# EAGLE design v1 (EAGLE 9.1.0)
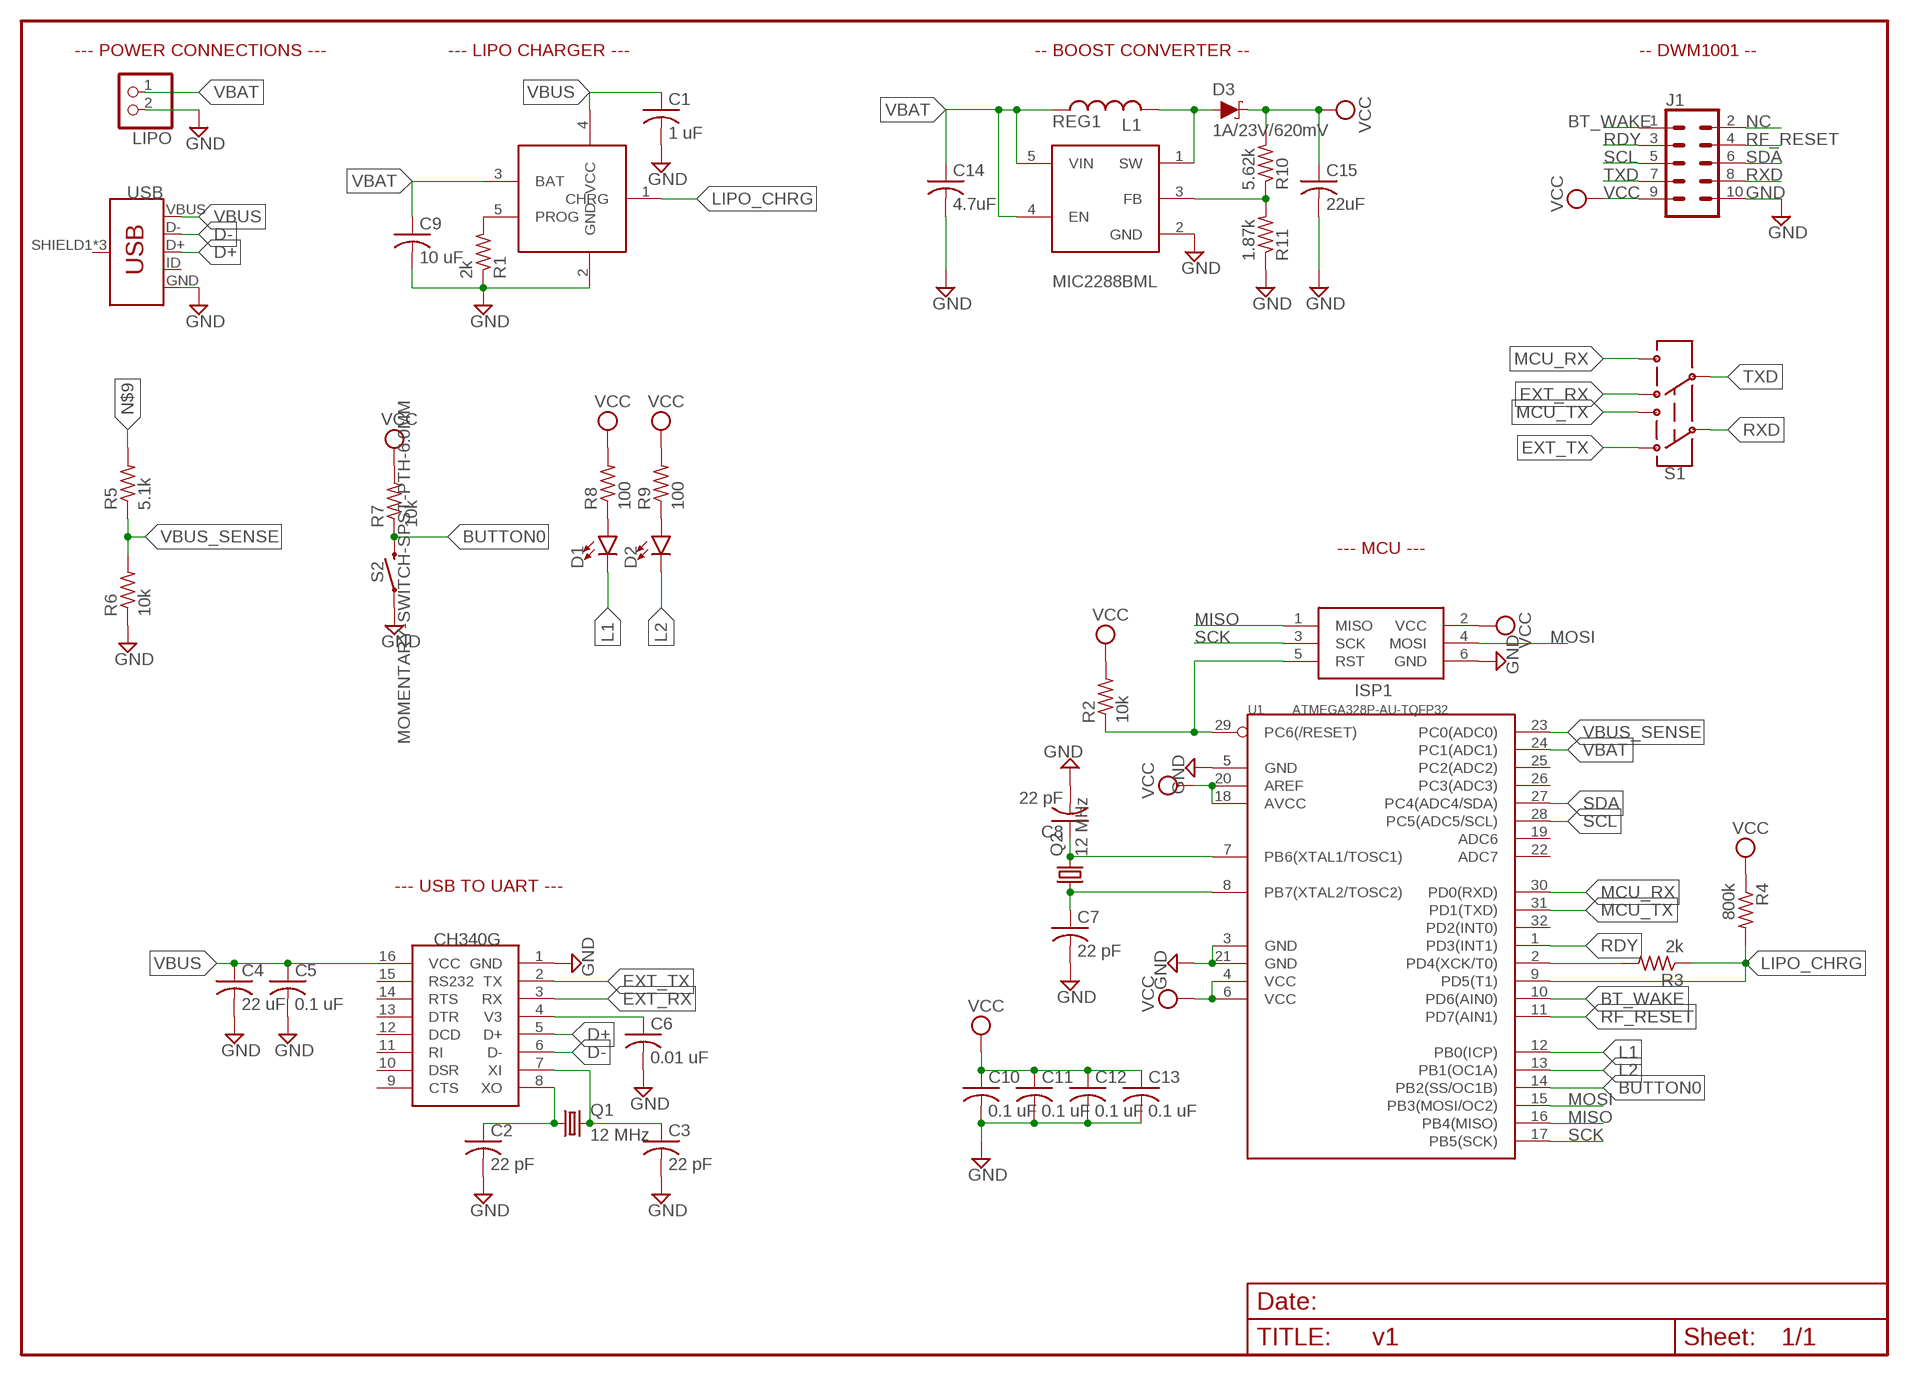
[diagram p0: schematic, sheet 1]

## Parts
C1  1 uF  C-USC0603  [C0603]
C2  22 pF  C-USC0603  [C0603]
C3  22 pF  C-USC0603  [C0603]
C4  22 uF  C-USC0603  [C0603]
C5  0.1 uF  C-USC0603  [C0603]
C6  0.01 uF  C-USC0603  [C0603]
C7  22 pF  C-USC0603  [C0603]
C8  22 pF  C-USC0603  [C0603]
C9  10 uF  C-USC0603  [C0603]
C10  0.1 uF  C-USC0603  [C0603]
C11  0.1 uF  C-USC0603  [C0603]
C12  0.1 uF  C-USC0603  [C0603]
C13  0.1 uF  C-USC0603  [C0603]
C14  4.7uF  C-USC0603  [C0603]
C15  22uF  C-USC0603  [C0603]
D1  LED0603  [LED-0603]
D2  LED0603  [LED-0603]
D3  1A/23V/620mV  DIODE-SCHOTTKY-BAT20J  [SOD-323]
ISP1  AVRISP-BOX  [AVRISP-BOX]
J1  CONN_05X2SHD  [2X5-SHROUDED]
L1  L-USL4532P  [L4532P]
LIPO  JST_2PIN-THM  [JST-PH-2-THM]
Q1  12 MHz  CRYSTALSM49  [SM49]
Q2  12 MHz  CRYSTALSM49  [SM49]
R1  2k  R-US_R0603  [R0603]
R2  10k  R-US_R0603  [R0603]
R3  2k  R-US_R0603  [R0603]
R4  800k  R-US_R0603  [R0603]
R5  5.1k  R-US_R0603  [R0603]
R6  10k  R-US_R0603  [R0603]
R7  10k  R-US_R0603  [R0603]
R8  100  R-US_R0603  [R0603]
R9  100  R-US_R0603  [R0603]
R10  5.62k  R-US_R0603  [R0603]
R11  1.87k  R-US_R0603  [R0603]
REG1  MIC2288BML  [SOT23-5L]
S1  SWITCH-DPDT-SMD-AYZ0202  [SWITCH_DPDT_SMD_AYZ0202]
S2  MOMENTARY-SWITCH-SPST-PTH-6.0MM  [TACTILE_SWITCH_PTH_6.0MM]
U1  ATMEGA328P-AU-TQFP32  MCU-ATMEGA328P-AU(TQFP32)  [TQFP32-0.8-7X7MM]
U$1  LTC4054  [LTC4054]
U$2  CH340G  [SOIC16]
USB  USB_MICRO-B_FEMALE-SMT  [USB-B-MICRO-SMD]

## Nets
BT_WAKE: J1.1 U1.10(PD6(AIN0))
BUTTON0: R7.1 S2.3 U1.14(PB2(SS/OC1B))
D+: U$2.5(D+) USB.D+
D-: U$2.6(D-) USB.D-
EXT_RX: S1.4 U$2.3(RX)
EXT_TX: S1.1 U$2.2(TX)
GND: C1.2 C2.2 C3.2 C4.2 C5.2 C6.2 C7.2 C8.2 C9.2 C10.2 C11.2 C12.2 C13.2 C14.2 C15.2 ISP1.6(GND) J1.10 LIPO.2 R1.1 R6.1 R11.1 REG1.2(GND) S2.1 U1.3(GND) U1.5(GND) U1.21(GND) U$1.2(GND) U$2.1(GND) USB.GND
L1: D1.C U1.12(PB0(ICP))
L2: D2.C U1.13(PB1(OC1A))
LIPO_CHRG: R3.1 R4.2 U1.9(PD5(T1)) U$1.1(CHRG)
MCU_RX: S1.6 U1.30(PD0(RXD))
MCU_TX: S1.3 U1.31(PD1(TXD))
MISO: ISP1.1(MISO) U1.16(PB4(MISO))
MOSI: ISP1.4(MOSI) U1.15(PB3(MOSI/OC2))
N$1: R1.2 U$1.5(PROG)
N$2: R3.2 U1.2(PD4(XCK/T0))
N$3: C6.1 U$2.4(V3)
N$4: C8.1 Q2.2 U1.7(PB6(XTAL1/TOSC1))
N$5: C3.1 Q1.2 U$2.7(XI)
N$6: C2.1 Q1.1 U$2.8(XO)
N$7: ISP1.5(RST) R2.1 U1.29(PC6(/RESET))
N$8: C7.1 Q2.1 U1.8(PB7(XTAL2/TOSC2))
N$9: R5.2
N$10: D1.A R8.1
N$11: D2.A R9.1
N$13: D3.A L1.2 REG1.1(SW)
N$16: R10.1 R11.2 REG1.3(FB)
NC: J1.2
RDY: J1.3 U1.1(PD3(INT1))
RF_RESET: J1.4 U1.11(PD7(AIN1))
RXD: J1.8 S1.2
SCK: ISP1.3(SCK) U1.17(PB5(SCK))
SCL: J1.5 U1.28(PC5(ADC5/SCL))
SDA: J1.6 U1.27(PC4(ADC4/SDA))
TXD: J1.7 S1.5
VBAT: C9.1 C14.1 L1.1 LIPO.1 REG1.4(EN) REG1.5(VIN) U1.24(PC1(ADC1)) U$1.3(BAT)
VBUS: C1.1 C4.1 C5.1 U$1.4(VCC) U$2.16(VCC) USB.VBUS
VBUS_SENSE: R5.1 R6.2 U1.23(PC0(ADC0))
VCC: C10.1 C11.1 C12.1 C13.1 C15.1 D3.C ISP1.2(VCC) J1.9 R2.2 R4.1 R7.2 R8.2 R9.2 R10.2 U1.4(VCC) U1.6(VCC) U1.18(AVCC) U1.20(AREF)
Unconnected: U1.19(ADC6) U1.22(ADC7) U1.25(PC2(ADC2)) U1.26(PC3(ADC3)) U1.32(PD2(INT0)) U$2.9(CTS) U$2.10(DSR) U$2.11(RI) U$2.12(DCD) U$2.13(DTR) U$2.14(RTS) U$2.15(RS232) USB.ID USB.SHIELD1(SHIELD) USB.SHIELD2(SHIELD) USB.SHIELD3(SHIELD)

## Notes on the sheet
- --- POWER CONNECTIONS --- | --- LIPO CHARGER --- | -- BOOST CONVERTER -- | -- DWM1001 --
- --- MCU ---
- --- USB TO UART ---

## Library data of the parts
C1-C15 = rcl:C-US: CAPACITOR, American symbol
D1 D2 = SparkFun-LED:LED: LED (Generic) Standard schematic elements and footprints for 5mm, 3mm, 1206, and 0603 sized LEDs. Generic LEDs with no color specified.
D3 = SparkFun-DiscreteSemi:DIODE-SCHOTTKY: Schottky diode A Schottky diode is a semiconductor diode which has a low forward voltage drop and a very fast switching action.; PROD_ID: DIO-11623
ISP1 = adafruit:AVRISP: AVR ISP HEADER Standard 6 pin header for AVR programming
J1 = SparkFun-Connectors:CONN_05X2: Multi connection point. Often used as Generic Header-pin footprint for 0.1 inch spaced/style header connections For AVR SPI programming port, see special device with nice symbol: "AVR_SPI_PROG_5x2.dev" You can populate with any combo of single row headers, but if you'd like an exact match, check these: 2x5 AVR ICSP Male Header <https://www.sparkfun.com/products/778> (PRT-00778) 2x5 Pin Shrouded Header <https://www.sparkfun.com/products/8506> (PRT-08506) On any of the 0.1 inch spaced packages, you can populate with these: Break Away Headers - Straight <https://www.sparkfun.com/products/116> (PRT-00116) Break Away Male Headers - Right Angle <https://www.sparkfun.com/products/553> (PRT-00553) Female Headers <https://www.sparkfun.com/products/115> (PRT-00115) Break Away Headers - Machine Pin <https://www.sparkfun.com/products/117> (PRT-00117) Break Away Female Headers - Swiss Machine Pin <https://www.sparkfun.com/products/743> (PRT-00743) Special note: the shrouded connector mates well with our 5x2 ribbon cables: 2x5 Pin IDC Ribbon Cable <https://www.sparkfun.com/products/8535> (PRT-08535); PROD_ID: CONN-08671; SF_ID: PRT-08506
L1 = rcl:L-US: INDUCTOR, American symbol
LIPO = adafruit:JST_2PIN: JST 2-Pin Connectors of various flavors SMT-RA (S2B-PH-SM4) 4UConnector #17311 SMT (B2B-PH-SM4) THM-RA (S2B-PH) THM (B2B-PH)
Q1 Q2 = RMSlib:CRYSTAL: CRYSTAL; OC_FARNELL: unknown; OC_NEWARK: unknown
R1-R11 = rcl:R-US_: RESISTOR, American symbol
REG1 = MIC2288:MIC2288BML: Boost 3V-4.2V input to adjustable output (Micrel)
S1 = SparkFun-Switches:SWITCH-DPDT: Double-Pole, Double-Throw (DPDT) Switch Double-pole, double-throw switches. Variant Overview PTH-GPI-152-3013 Used on SparkFun Geiger Counter <https://www.sparkfun.com/products/11345> SMD-AY0202 Surface Mount DPDT Switch <https://www.sparkfun.com/products/597> (COM-00597) Used on e.g. LilyPad Arduino USB - ATmega32U4 Board <https://www.sparkfun.com/products/12049>; PROD_ID: SWCH-08179; SF_SKU: COM-00597
S2 = SparkFun-Switches:MOMENTARY-SWITCH-SPST: Momentary Switch (Pushbutton) - SPST Normally-open (NO) SPST momentary switches (buttons, pushbuttons). Variants PTH-12MM - 12mm square, through-hole Momentary Pushbutton Switch - 12mm Square <https://www.sparkfun.com/products/9190> (COM-09190) PTH-6.0MM, PTH-6.0MM-KIT - 6.0mm square, through-hole Mini Pushbutton Switch <https://www.sparkfun.com/products/97> (COM-00097) KIT package intended for soldering kit's - only one side of pads' copper is exposed. PTH-RIGHT-ANGLE-KIT - Right-angle, through-hole Right Angle Tactile Button <https://www.sparkfun.com/products/10791> - Used on SparkFun BigTime Watch Kit <https://www.sparkfun.com/products/11734> SMD-12MM - 12mm square, surface-mount Tactile Button - SMD (12mm) <https://www.sparkfun.com/products/12993> (COM-12993) Used on SparkFun PicoBoard <https://www.sparkfun.com/products/11888> SMD-4.5MM - 4.5mm Square Trackball Switch Used on SparkFun Blackberry Trackballer Breakout <https://www.sparkfun.com/products/13169> SMD-4.6MMX2.8MM - 4.60mm x 2.80mm, surface mount Used on SparkFun SAMD21 Mini Breakout <https://www.sparkfun.com/products/13664> SMD-5.2MM, SMD-5.2-REDUNDANT - 5.2mm square, surface-mount Mini Pushbutton Switch - SMD <https://www.sparkfun.com/products/8720> (COM-08720) Used on Arduino Pro Mini <https://www.sparkfun.com/products/11114> REDUNDANT package connects both switch circuits together SMD-6.0X3.5MM - 6.0 x 3.5mm, surface mount Momentary Reset Switch SMD <https://www.sparkfun.com/products/8229> (COM-08229) SMD-6.2MM-TALL - 6.2mm square, surface mount Tactile Button - SMD (6mm) <https://www.sparkfun.com/products/12992> Used on SparkFun Digital Sandbox <https://www.sparkfun.com/products/12651> SMD-RIGHT-ANGLE - Right-angle, surface mount Used on SparkFun Block for Intel® Edison - Arduino <https://www.sparkfun.com/products/13036>; PROD_ID: SWCH-08441; SF_SKU: COM-00097
U1 = Seeed-IC:MCU-ATMEGA328P-AU(TQFP32): 310010049; MPN: ATMEGA328P-AU
U$1 = LTC4054:LTC4054: LTC4054 Li-ion Charger IC TSOT 5
U$2 = ch340g:CH340G
USB = SparkFun-Connectors:USB_MICRO-B: USB Type Micro-B Connector Male/female and PTH/SMT variants SparkFun Products: SparkFun microB USB Breakout <https://www.sparkfun.com/products/12035> SparkFun USB microB Plug Breakout <https://www.sparkfun.com/products/10031> SparkFun ESP8266 Thing <https://www.sparkfun.com/products/13231>; PROD_ID: CONN-11752

## Board
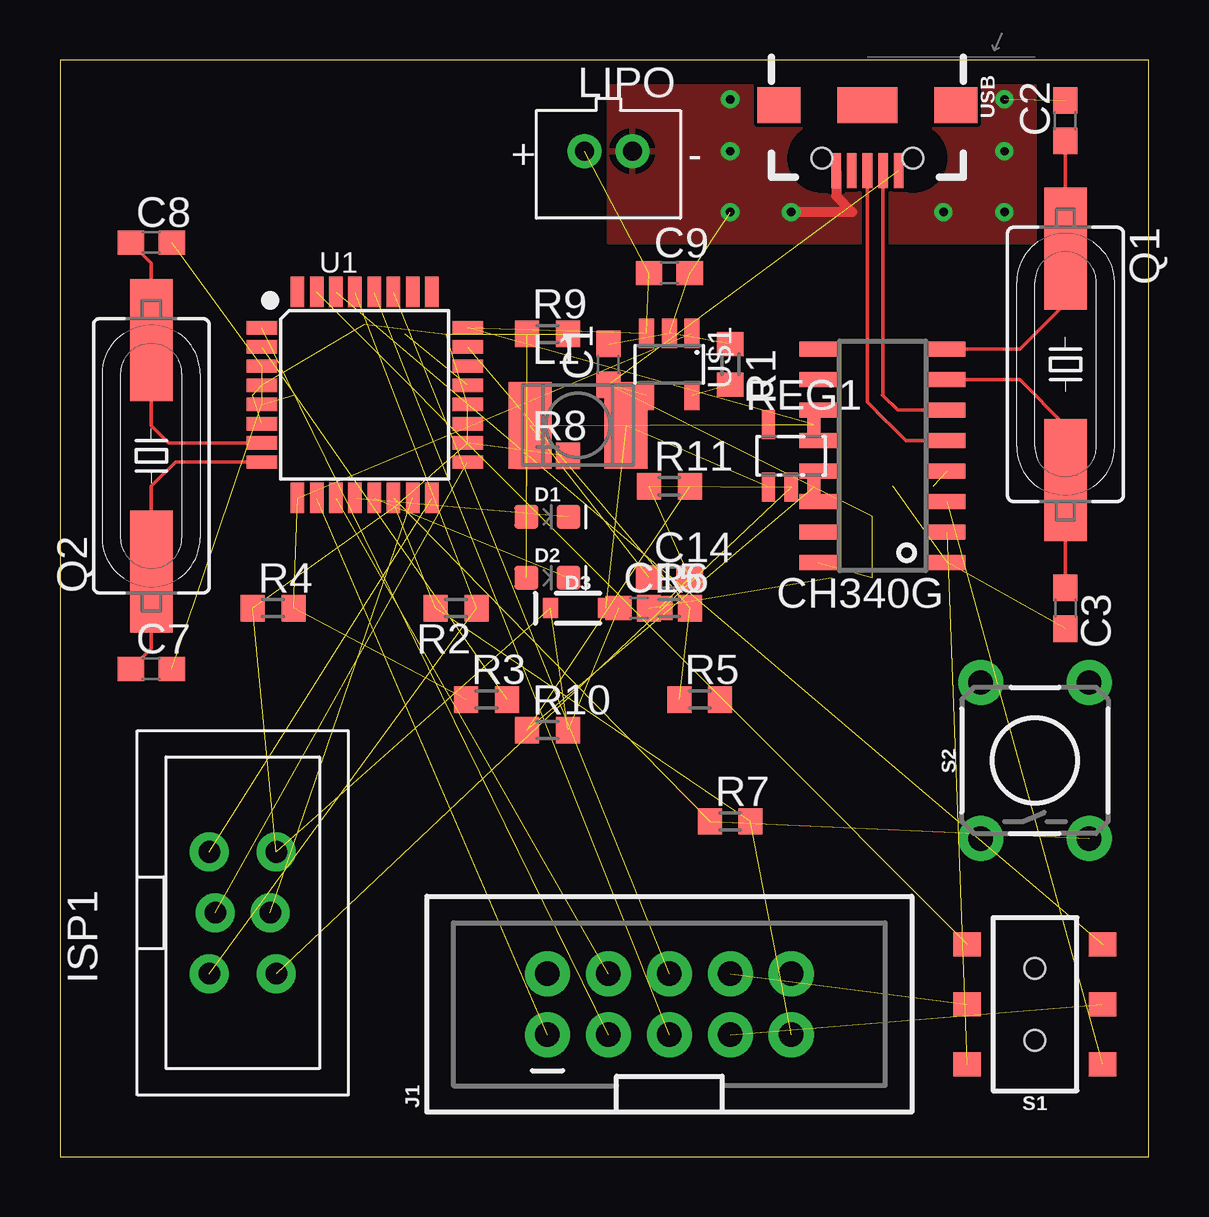
[diagram p1: board, top side]
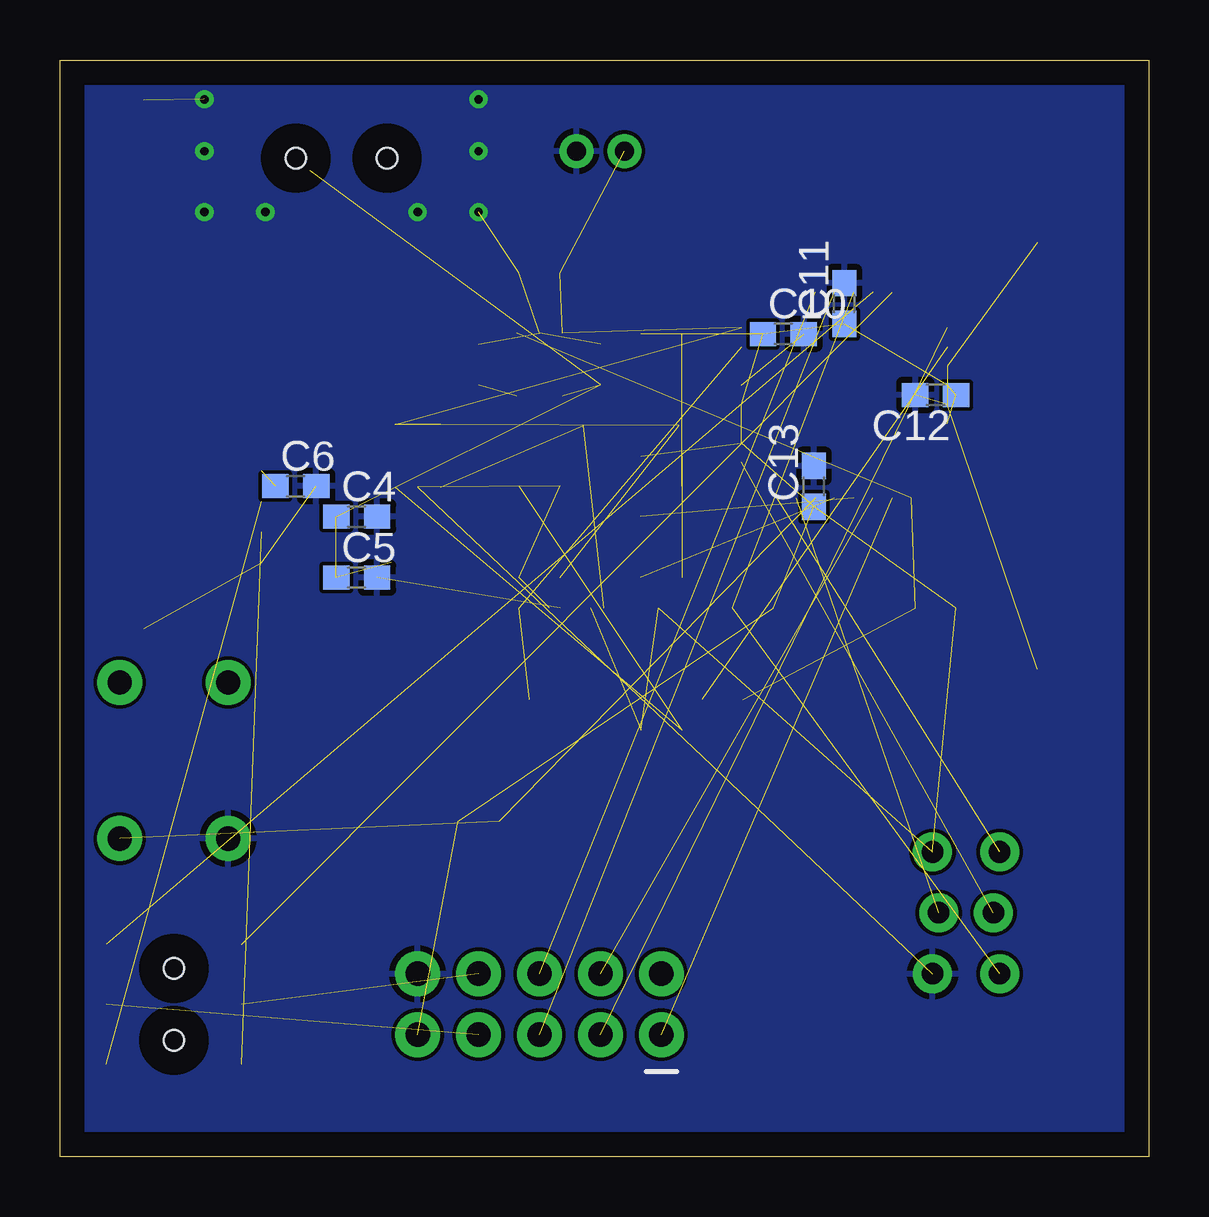
[diagram p2: board, bottom side, seen from below]

Size 45.39 x 45.71 mm. Coordinates in mm from the lower left corner, seen from the top.
Outline: 0,0 45.39,0 45.39,45.71 0,45.71 0,0
Copper layers (1*16): Top 0.035mm / dielectric 1.5mm / Bottom 0.035mm
Design rules "default": minimum track width 6mil, minimum drill 0.35mm, track to track 6mil, track to pad 6mil, pad to pad 6mil, via to via 6mil, smd to smd 6mil, copper to edge 40mil, drill to drill 6mil, minimum pad ring 10mil, minimum via ring 8mil, stop-mask expansion 4mil, vias tented up to drill 0mil, thermal gap 10mil

### Footprints (pad centres in the part's own frame; a part is rotated, then mirrored left to right if it is on the bottom)
C0603 = smd 1.1 x 1: 1 -0.85,0; 2 0.85,0
LED-0603 = smd 1 x 1: A -0.877,0; C 0.877,0
SOD-323 = smd 0.63 x 0.83: A 1.15,0; C -1.15,0
AVRISP-BOX = drill 0.9 pad 1.626: 1 -1.397,2.54; 2 1.397,2.54; 3 -1.143,0; 4 1.143,0; 5 -1.397,-2.54; 6 1.397,-2.54
2X5-SHROUDED = drill 1.016 pad 1.88: 1 -1.27,5.08; 2 1.27,5.08; 3 -1.27,2.54; 4 1.27,2.54; 5 -1.27,0; 6 1.27,0; 7 -1.27,-2.54; 8 1.27,-2.54; 9 -1.27,-5.08; 10 1.27,-5.08
L4532P = smd 1.8 x 3.6: 1 -2,0; 2 2,0
JST-PH-2-THM = drill 0.8 pad 1.422: 1 1,0; 2 -1,0
SM49 = smd 5.08 x 1.778: 1 -4.826,0; 2 4.826,0
R0603 = smd 1 x 1.1: 1 -0.85,0; 2 0.85,0
SOT23-5L = smd 0.55 x 1.2: 1 -0.95,-1.3; 2 0,-1.3; 3 0.95,-1.3; 4 0.95,1.3; 5 -0.95,1.3
SWITCH_DPDT_SMD_AYZ0202 = smd 1 x 1.15: 1 -2.5,2.825; 2 0,2.825; 3 2.5,2.825; 4 -2.5,-2.825; 5 0,-2.825; 6 2.5,-2.825 | hole 0.85: 1.5,0; -1.5,0
TACTILE_SWITCH_PTH_6.0MM = drill 1.016 pad 1.88: 1 -3.251,2.261; 2 3.251,2.261; 3 -3.251,-2.261; 4 3.251,-2.261
TQFP32-0.8-7X7MM = smd 1.27 x 0.559: 1 -4.293,2.8; 2 -4.293,2; 3 -4.293,1.2; 4 -4.293,0.4; 5 -4.293,-0.4; 6 -4.293,-1.2; 7 -4.293,-2; 8 -4.293,-2.8; 17 4.293,-2.8; 18 4.293,-2; 19 4.293,-1.2; 20 4.293,-0.4; 21 4.293,0.4; 22 4.293,1.2; 23 4.293,2; 24 4.293,2.8 | smd 0.559 x 1.27: 9 -2.8,-4.293; 10 -2,-4.293; 11 -1.2,-4.293; 12 -0.4,-4.293; 13 0.4,-4.293; 14 1.2,-4.293; 15 2,-4.293; 16 2.8,-4.293; 25 2.8,4.293; 26 2,4.293; 27 1.2,4.293; 28 0.4,4.293; 29 -0.4,4.293; 30 -1.2,4.293; 31 -2,4.293; 32 -2.8,4.293
LTC4054 = smd 0.62 x 1.22: 1 -0.95,-1.3; 2 0,-1.3; 3 0.95,-1.3; 4 0.95,1.3; 5 -0.95,1.3
SOIC16 = smd 0.635 x 1.524: 1 -4.445,-2.695; 2 -3.175,-2.695; 3 -1.905,-2.695; 4 -0.635,-2.695; 5 0.635,-2.695; 6 1.905,-2.695; 7 3.175,-2.695; 8 4.445,-2.695; 9 4.445,2.695; 10 3.175,2.695; 11 1.905,2.695; 12 0.635,2.695; 13 -0.635,2.695; 14 -1.905,2.695; 15 -3.175,2.695; 16 -4.445,2.695
USB-B-MICRO-SMD = smd 1.45 x 0.4: D+ 2.725,0; D- 2.725,0.65; GND 2.725,-1.3; ID 2.725,-0.65; VBUS 2.725,1.3 | smd 1.5 x 1.8: SHIELD1 0,3.685; SHIELD2 0,-3.685 | smd 1.5 x 2.5: SHIELD3 0,0 | hole 0.85: 2.2,1.9; 2.2,-1.9

### Placement (x,y rotation side)
C1  22.86,33.02 90 top
C2  41.91,43.18 90 top
C3  41.91,22.86 270 top
C4  33.02,26.67 0 bottom
C5  33.02,24.13 0 bottom
C6  35.56,27.94 0 bottom
C7  3.81,20.32 0 top
C8  3.81,38.1 0 top
C9  25.4,36.83 0 top
C10  15.24,34.29 0 bottom
C11  12.7,35.56 90 bottom
C12  8.89,31.75 180 bottom
C13  13.97,27.94 90 bottom
C14  25.4,24.13 0 top
C15  24.13,22.86 0 top
D1  20.32,26.67 0 top
D2  20.32,24.13 0 top
D3  21.59,22.86 0 top
ISP1  7.62,10.16 0 top
J1  25.4,6.35 90 top
L1  21.59,30.48 0 top
LIPO  22.86,41.91 180 top
Q1  41.91,33.02 270 top
Q2  3.81,29.21 90 top
R1  27.94,33.02 270 top
R2  16.51,22.86 180 top
R3  17.78,19.05 0 top
R4  8.89,22.86 0 top
R5  26.67,19.05 0 top
R6  25.4,22.86 0 top
R7  27.94,13.97 0 top
R8  20.32,29.21 0 top
R9  20.32,34.29 0 top
R10  20.32,17.78 0 top
R11  25.4,27.94 0 top
REG1  30.48,29.21 0 top
S1  40.64,6.35 90 top
S2  40.64,16.51 90 top
U1  12.7,31.75 0 top
U$1  25.4,33.02 180 top
U$2  34.29,29.21 90 top
USB  33.66,43.81 270 top

### Tracks (layer width: path | path; a pad name or v marks a point on that pad's centre or on a via)
BT_WAKE  (1 unrouted)
BUTTON0  (2 unrouted)
D+
  Top 0.152: USB.D+ 33.66,31.45 34.45,30.64 34.53,30.57 35.26,29.84 U$2.5
D-
  Top 0.152: USB.D- 34.3,31.77 34.29,31.75 34.92,31.11 U$2.6
EXT_RX  (1 unrouted)
EXT_TX  (1 unrouted)
GND  (via drill 0.35)  (17 unrouted)
  Top 0.406: USB.GND 32.35,40.03 33.02,39.37 v30.48,39.37
  other vias: 27.94,44.07 27.94,41.91 27.94,39.37 36.83,39.37 39.37,39.37 39.37,41.91 39.37,44.07
  pour Bottom: 0,45.72 45.72,45.72 45.72,0 0,0
  pour Top: 22.86,45.72 40.64,45.72 40.64,38.1 22.86,38.1
L1  (1 unrouted)
L2  (1 unrouted)
LIPO_CHRG  (3 unrouted)
MCU_RX  (1 unrouted)
MCU_TX  (1 unrouted)
MISO  (1 unrouted)
MOSI  (1 unrouted)
N$1  (1 unrouted)
N$2  (1 unrouted)
N$3  (1 unrouted)
N$4
  Top 0.152: U1.7 4.54,29.75 3.81,30.48 Q2.2 3.81,37.25 C8.1
N$5
  Top 0.152: U$2.7 40.01,32.38 41.91,30.48 Q1.2 C3.1
N$6
  Top 0.152: U$2.8 40.01,33.66 41.91,35.56 Q1.1 C2.1
N$7  (2 unrouted)
N$8
  Top 0.152: U1.8 4.82,28.95 3.81,27.94 Q2.1 3.81,21.17 C7.1
N$10  (1 unrouted)
N$11  (1 unrouted)
N$13  (2 unrouted)
N$16  (2 unrouted)
RDY  (1 unrouted)
RF_RESET  (1 unrouted)
RXD  (1 unrouted)
SCK  (1 unrouted)
SCL  (1 unrouted)
SDA  (1 unrouted)
TXD  (1 unrouted)
VBAT  (7 unrouted)
VBUS  (5 unrouted)
VBUS_SENSE  (2 unrouted)
VCC  (17 unrouted)